# EAGLE design accy_feather (EAGLE 8.0.0)
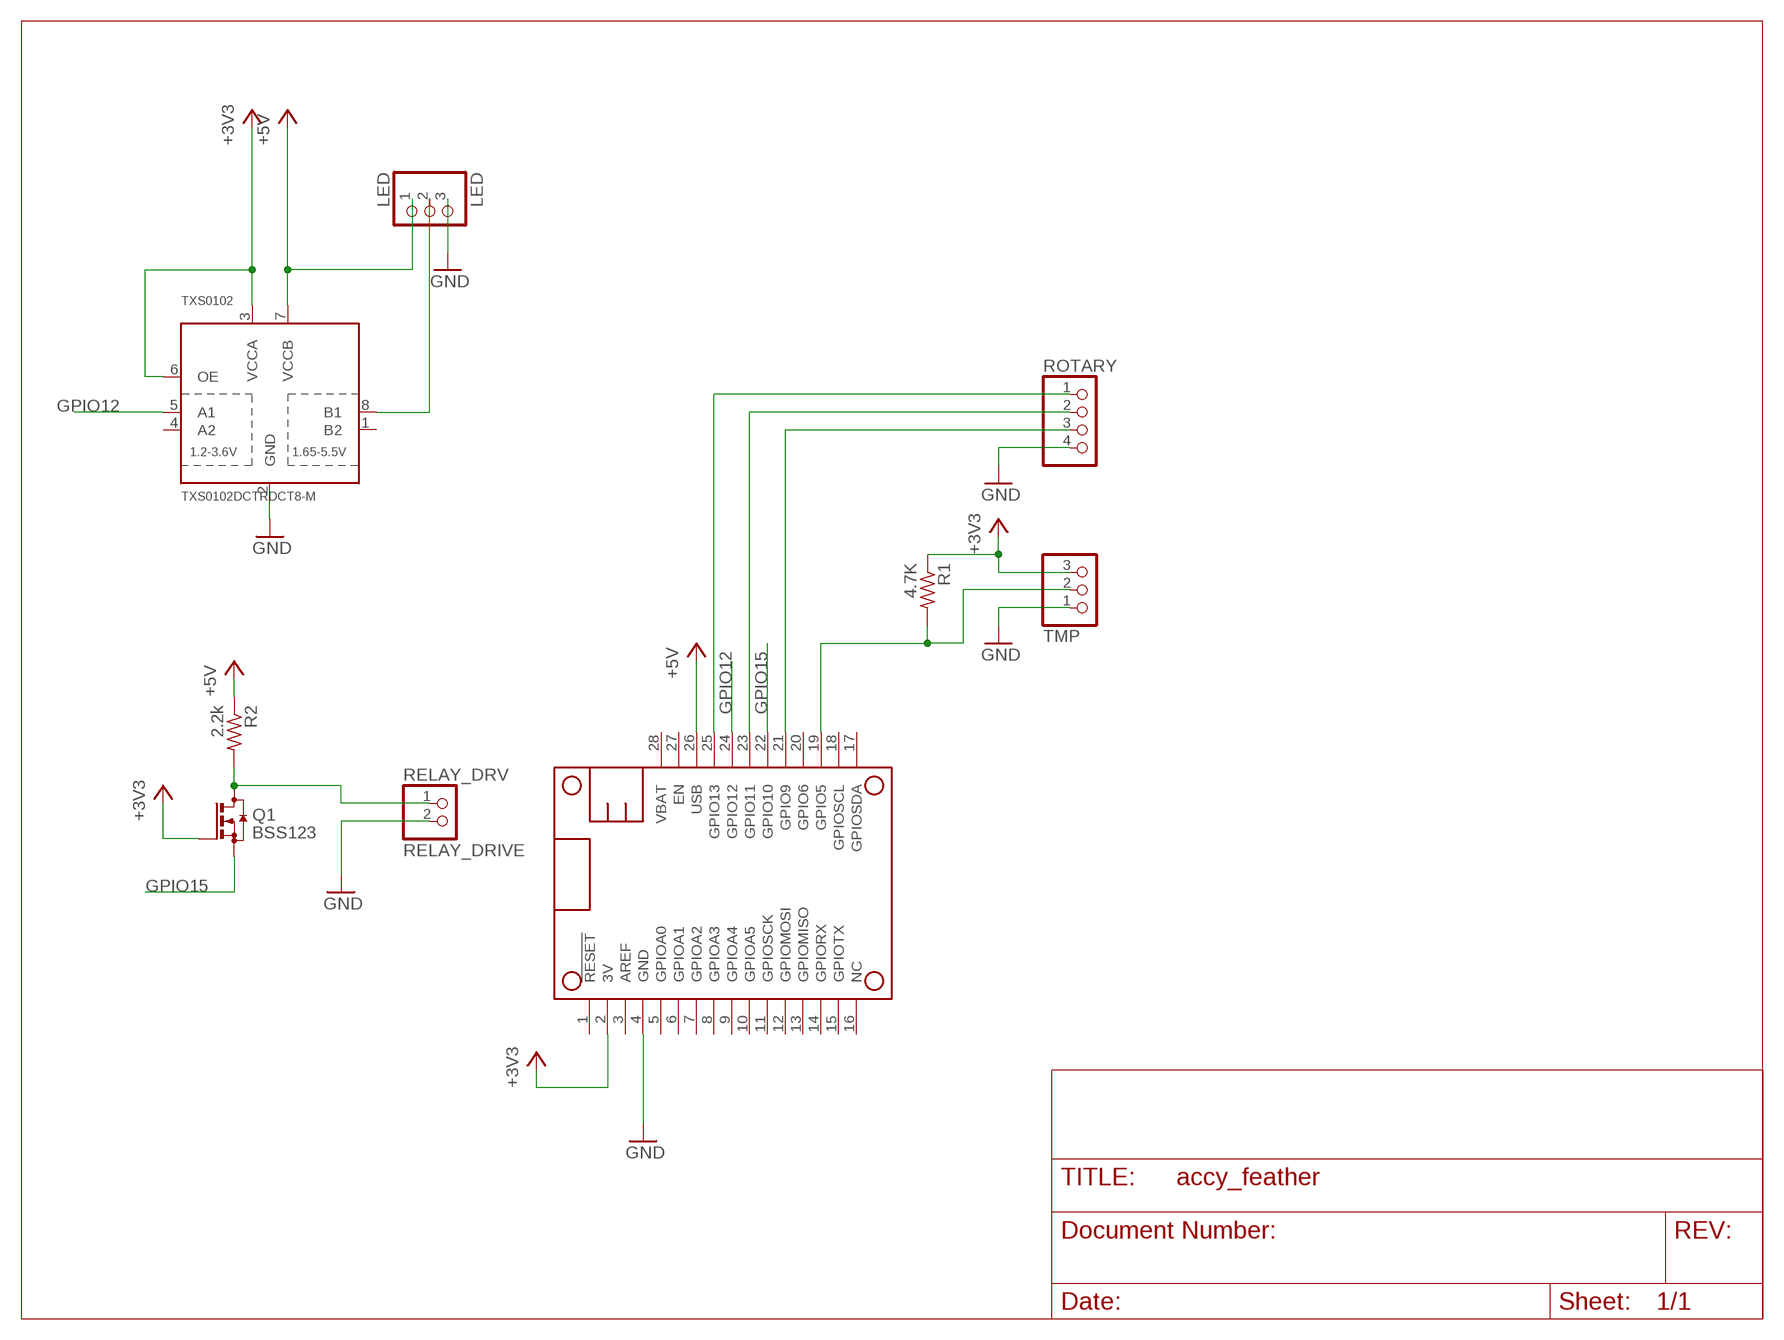
[diagram p0: schematic, sheet 1]

## Parts
LED  LED  PINHD-1X3CB  [1X03-CLEANBIG]
MS1  FEATHERWING  [FEATHERWING]
Q1  BSS123  [SOT23]
R1  4.7K  R-US_R0603  [R0603]
R2  2.2k  R-US_R0603  [R0603]
RELAY_DRV  RELAY_DRIVE  PINHD-1X2  [1X02]
ROTARY  PINHD-1X4  [1X04]
TMP  PINHD-1X3CB  [1X03-CLEANBIG]
TXS0102  TXS0102DCTRDCT8-M  [DCT8-M]

## Nets
+3V3: MS1.2(3V) Q1.1(G) R1.1 TMP.3 TXS0102.3(VCCA) TXS0102.6(OE)
+5V: LED.1 MS1.26(USB) R2.1 TXS0102.7(VCCB)
BTN: MS1.21(GPIO9) ROTARY.3
GND: LED.3 MS1.4(GND) RELAY_DRV.2 ROTARY.4 TMP.1 TXS0102.2(GND)
GPIO12: MS1.24(GPIO12) TXS0102.5(A1)
GPIO15: MS1.22(GPIO10) Q1.2(S)
LED_DATA: LED.2 TXS0102.8(B1)
N$1: Q1.3(D) R2.2 RELAY_DRV.1
ROT1: MS1.25(GPIO13) ROTARY.1
ROT2: MS1.23(GPIO11) ROTARY.2
TMP_DATA: MS1.19(GPIO5) R1.2 TMP.2
Unconnected: MS1.1(!RESET) MS1.3(AREF) MS1.5(GPIOA0) MS1.6(GPIOA1) MS1.7(GPIOA2) MS1.8(GPIOA3) MS1.9(GPIOA4) MS1.10(GPIOA5) MS1.11(GPIOSCK) MS1.12(GPIOMOSI) MS1.13(GPIOMISO) MS1.14(GPIORX) MS1.15(GPIOTX) MS1.16(NC) MS1.17(GPIOSDA) MS1.18(GPIOSCL) MS1.20(GPIO6) MS1.27(EN) MS1.28(VBAT) TXS0102.1(B2) TXS0102.4(A2)

## Library data of the parts
LED TMP = adafruit:PINHD-1X3: PIN HEADER
MS1 = microbuilder:FEATHERWING
Q1 = transistor-small-signal:BSS123: N-CHANNEL MOS FET
R1 R2 = resistor:R-US_: RESISTOR, American symbol
RELAY_DRV = pinhead:PINHD-1X2: PIN HEADER
ROTARY = pinhead:PINHD-1X4: PIN HEADER
TXS0102 = DZ:TXS0102DCTR; 3D_LIBRARY_NAME: TI_AllParts_20121225; COPYRIGHT: Copyright C 2015 Accelerated Designs. All rights reserved; DATASHEETURL: httpwww.ti.comlitgpnTXS0102; DESCRIPTION: 2Bit Bidirectional VoltageLevel Translator for OpenDrain Application; FAMILY_NAME: AUTO DIRECTION SENSING DUAL SUPPLY TRANSLATOR; GENERIC_PART_NUMBER: TXS0102; INDUSTRY_STD_PKG_TYPE: SM8; MANUFACTURER: Texas Instruments; MANUFACTURER_PART_NUMBER: TXS0102DCTR; PACKAGE_DESIGNATOR: DCT; PIN_COUNT: 8; VENDOR: Texas Instruments

## Board
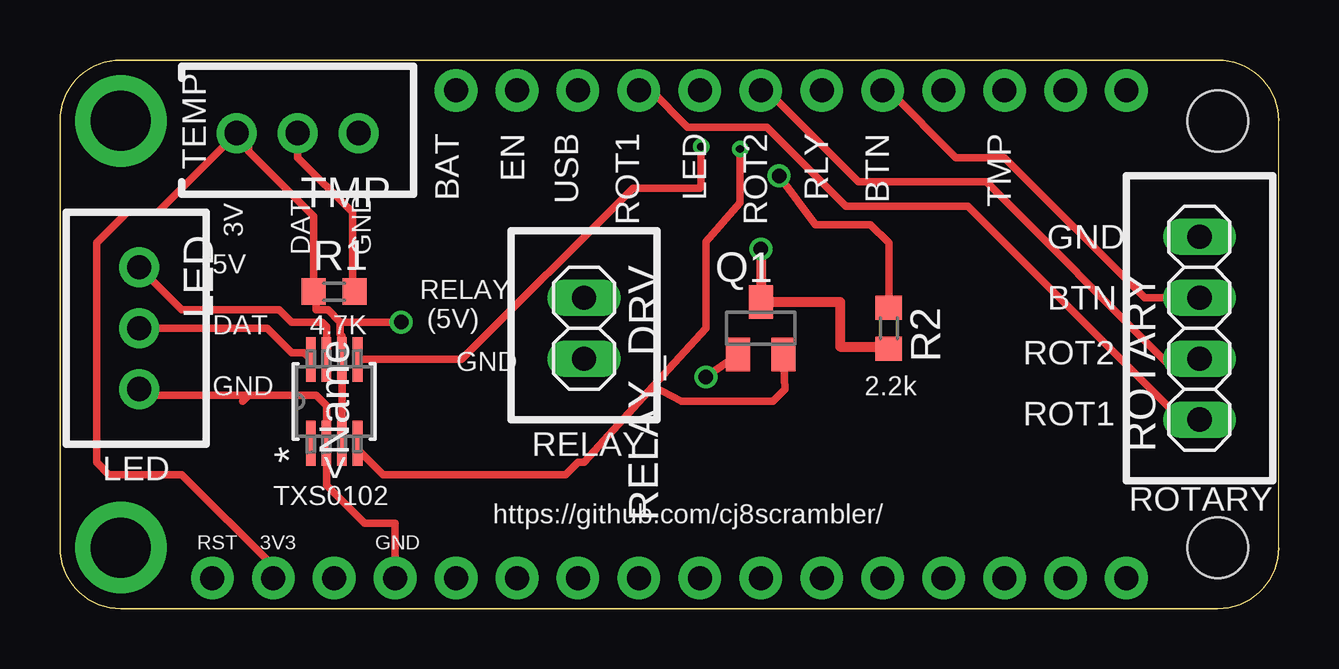
[diagram p1: board, top side]
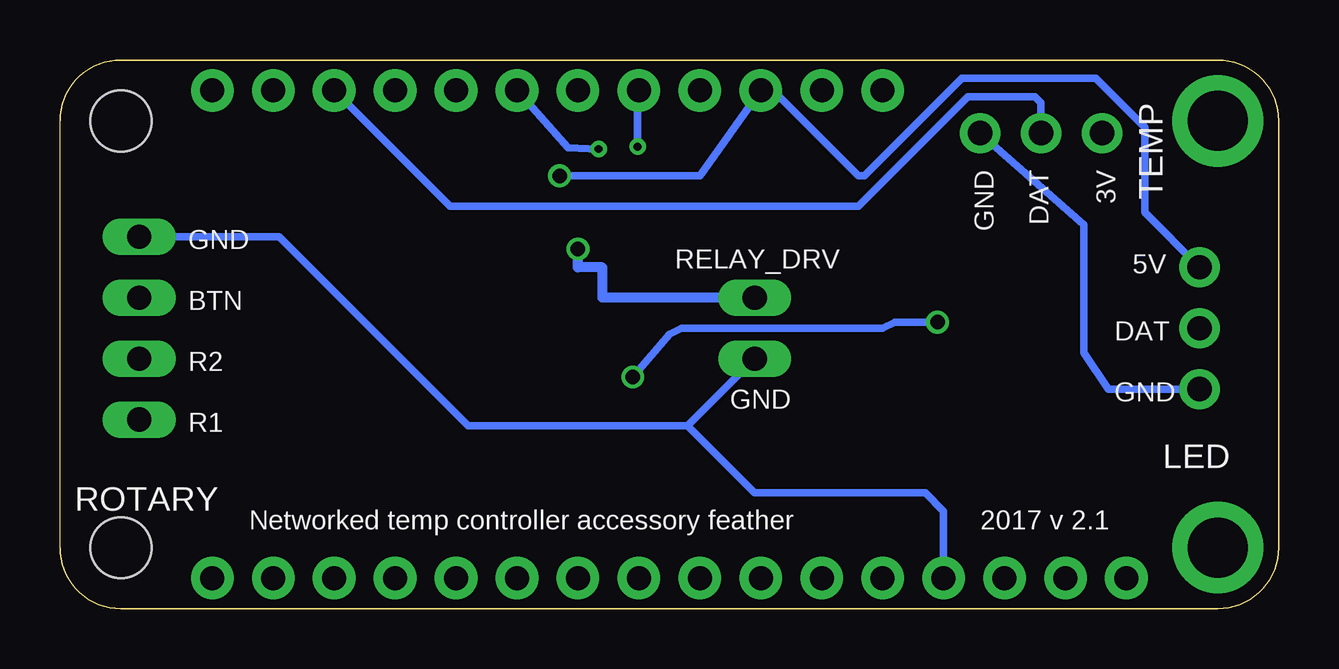
[diagram p2: board, bottom side, seen from below]

Size 50.8 x 22.86 mm. Coordinates in mm from the lower left corner, seen from the top.
Outline: 50.8,20.32 arc90 48.26,22.86 2.54,22.86 arc90 0,20.32 0,2.54 arc90 2.54,0 48.26,0 arc90 50.8,2.54
Copper layers (1*16): Top 0.0356mm / dielectric 1.5011mm / Bottom 0.0356mm
Design rules "OSHPark": minimum track width 6mil, minimum drill 13mil, track to track 6mil, track to pad 6mil, pad to pad 6mil, via to via 6mil, smd to smd 6mil, copper to edge 15mil, drill to drill 6mil, minimum pad ring 7mil, minimum via ring 7mil, stop-mask expansion 3mil, vias tented up to drill 0mil, thermal gap 10mil

### Footprints (pad centres in the part's own frame; a part is rotated, then mirrored left to right if it is on the bottom)
1X03-CLEANBIG = drill 1.016 pad 1.676: 1 -2.54,0; 2 0,0; 3 2.54,0
FEATHERWING = drill 1 pad 1.778: 1 6.35,1.27; 2 8.89,1.27; 3 11.43,1.27; 4 13.97,1.27; 5 16.51,1.27; 6 19.05,1.27; 7 21.59,1.27; 8 24.13,1.27; 9 26.67,1.27; 10 29.21,1.27; 11 31.75,1.27; 12 34.29,1.27; 13 36.83,1.27; 14 39.37,1.27; 15 41.91,1.27; 16 44.45,1.27; 17 44.45,21.59; 18 41.91,21.59; 19 39.37,21.59; 20 36.83,21.59; 21 34.29,21.59; 22 31.75,21.59; 23 29.21,21.59; 24 26.67,21.59; 25 24.13,21.59; 26 21.59,21.59; 27 19.05,21.59; 28 16.51,21.59 | drill 2.5 pad 3.81: P$1 2.54,20.32; P$2 2.54,2.54 | hole 2.54: 48.26,20.32; 48.26,2.54
SOT23 = smd 1 x 1.4: 1 -0.95,-1.1; 2 0.95,-1.1; 3 0,1.1
R0603 = smd 1 x 1.1: 1 -0.85,0; 2 0.85,0
1X02 = drill 1.016 long: 1 -1.27,0; 2 1.27,0
1X04 = drill 1.016 long: 1 -3.81,0; 2 -1.27,0; 3 1.27,0; 4 3.81,0
DCT8-M = smd 1.867 x 0.406: 1 -1.746,0.975; 2 -1.746,0.325; 3 -1.746,-0.325; 4 -1.746,-0.975; 5 1.746,-0.975; 6 1.746,-0.325; 7 1.746,0.325; 8 1.746,0.975

### Placement (x,y rotation side)
LED  3.3,11.68 270 top
MS1  0,0 0 top
Q1  29.21,11.68 0 top
R1  11.43,13.21 0 top
R2  34.54,11.68 270 top
RELAY_DRV  21.84,11.68 270 top
ROTARY  47.5,11.68 90 top
TMP  9.91,19.81 180 top
TXS0102  11.43,8.64 90 top

### Tracks (layer width: path | path; a pad name or v marks a point on that pad's centre or on a via)
+3V3  (via drill 0.6 pad 0.81)
  Top 0.305: TXS0102.3 TXS0102.6 11.76,11.36 11.68,11.43 11.68,11.94 | MS1.2 8.89,1.78 5.08,5.59 2.03,5.59 1.52,6.1 1.52,15.24 2.79,16.51 4.06,16.51 TMP.3 7.87,19.3 7.87,19.05 10.58,16.34 R1.1 10.67,13.12 10.67,12.45 11.18,12.45 11.68,11.94 | Q1.1 v26.92,9.65 | v14.22,11.94 11.68,11.94
  Bottom 0.305: v26.92,9.65 25.4,11.43 24.89,11.68 16.51,11.68 16,11.94 v14.22,11.94
+5V  (via drill 0.6)
  Top 0.305: TXS0102.7 11.11,11.76 10.92,11.94 9.65,11.94 9.14,12.45 5.08,12.45 LED.1 | R2.1 34.54,15.24 33.78,16 31.5,16 v29.97,18.03
  Bottom 0.305: LED.1 5.59,16.51 5.59,20.07 7.62,22.1 13.21,22.1 17.27,18.03 17.53,18.03 21.08,21.59 MS1.26 24.13,18.03 v29.97,18.03
BTN
  Top 0.305: MS1.21 34.54,21.59 37.34,18.8 39.37,18.8 45.21,12.95 ROTARY.3
GND
  Top 0.305: MS1.4 13.97,3.56 12.7,3.56 11.11,5.15 TXS0102.2 11.11,8.45 10.67,8.89 7.87,8.89 | 7.87,8.89 3.56,8.89 LED.3 | 7.62,8.64 7.87,8.89
  Bottom 0.305: TMP.1 8.13,16 8.13,10.67 7.11,9.14 LED.3 | ROTARY.4 41.66,15.49 33.78,7.62 24.64,7.62 | RELAY_DRV.2 24.64,7.62 | 24.64,7.62 21.84,4.83 14.73,4.83 13.97,4.06 MS1.4
GPIO12  (via drill 0.33)
  Top 0.305: 12.4,10.41 TXS0102.5 | v26.72,19.25 26.72,17.58 26.67,17.53 23.88,17.53 16.73,10.38 TXS0102.5 | 12.44,10.41 TXS0102.5
  Bottom 0.152: MS1.24 26.67,21.49
  Bottom 0.305: v26.72,19.25 26.72,21.54 MS1.24
GPIO15  (via drill 0.33)
  Top 0.305: v28.35,19.15 28.35,16.92 26.92,15.29 26.92,11.68 24.73,9.27 | 12.4,6.64 13.46,5.59 21.08,5.59 21.59,6.1 21.84,6.1 24.73,9.27 | Q1.2 30.23,9.14 29.72,8.64 25.91,8.64 24.73,9.27
  Bottom 0.152: MS1.22 31.7,21.49
  Bottom 0.305: v28.35,19.15 29.62,19.2 MS1.22
LED_DATA
  Top 0.305: TXS0102.8 10.17,10.67 9.65,10.67 8.64,11.68 LED.2
N$1  (via drill 0.6)
  Top 0.406: v29.21,14.99 Q1.3 32.51,12.78 32.51,10.92 34.54,10.92 R2.2
  Bottom 0.406: RELAY_DRV.1 28.19,12.95 28.19,14.22 29.21,14.22 v29.21,14.99
ROT1
  Top 0.305: MS1.25 24.64,21.59 26.16,20.07 29.46,20.07 32.77,16.76 37.85,16.76 46.74,7.87 ROTARY.1
ROT2
  Top 0.305: MS1.23 29.46,21.59 33.27,17.78 38.61,17.78 46.23,10.16 47.24,10.16 ROTARY.2
TMP_DATA
  Top 0.305: TMP.2 9.91,18.8 12.19,16.51 12.19,13.3 R1.2
  Bottom 0.305: TMP.2 9.91,21.08 10.16,21.34 12.95,21.34 17.53,16.76 34.54,16.76 MS1.19 39.37,21.34

### Text on the board
tPlace: BAT | EN | USB | ROT1 | LED | ROT2 | RLY | BTN | TMP | TEMP | 3V | DAT | GND | GND | 5V | RELAY / (5V) | BTN | DAT | 4.7K | GND | ROT2 | GND | 2.2k | ROT1 | RELAY | LED | ROTARY | TXS0102 | https://github.com/cj8scrambler/ | RST | 3V3 | GND
bPlace: TEMP | 3V | DAT | GND | RELAY_DRV | GND | 5V | BTN | DAT | R2 | GND | GND | LED | R1 | ROTARY | 2017 v 2.1 | Networked temp controller accessory feather